# Altium schematic sheet Machnguyenli.SchDoc
size A
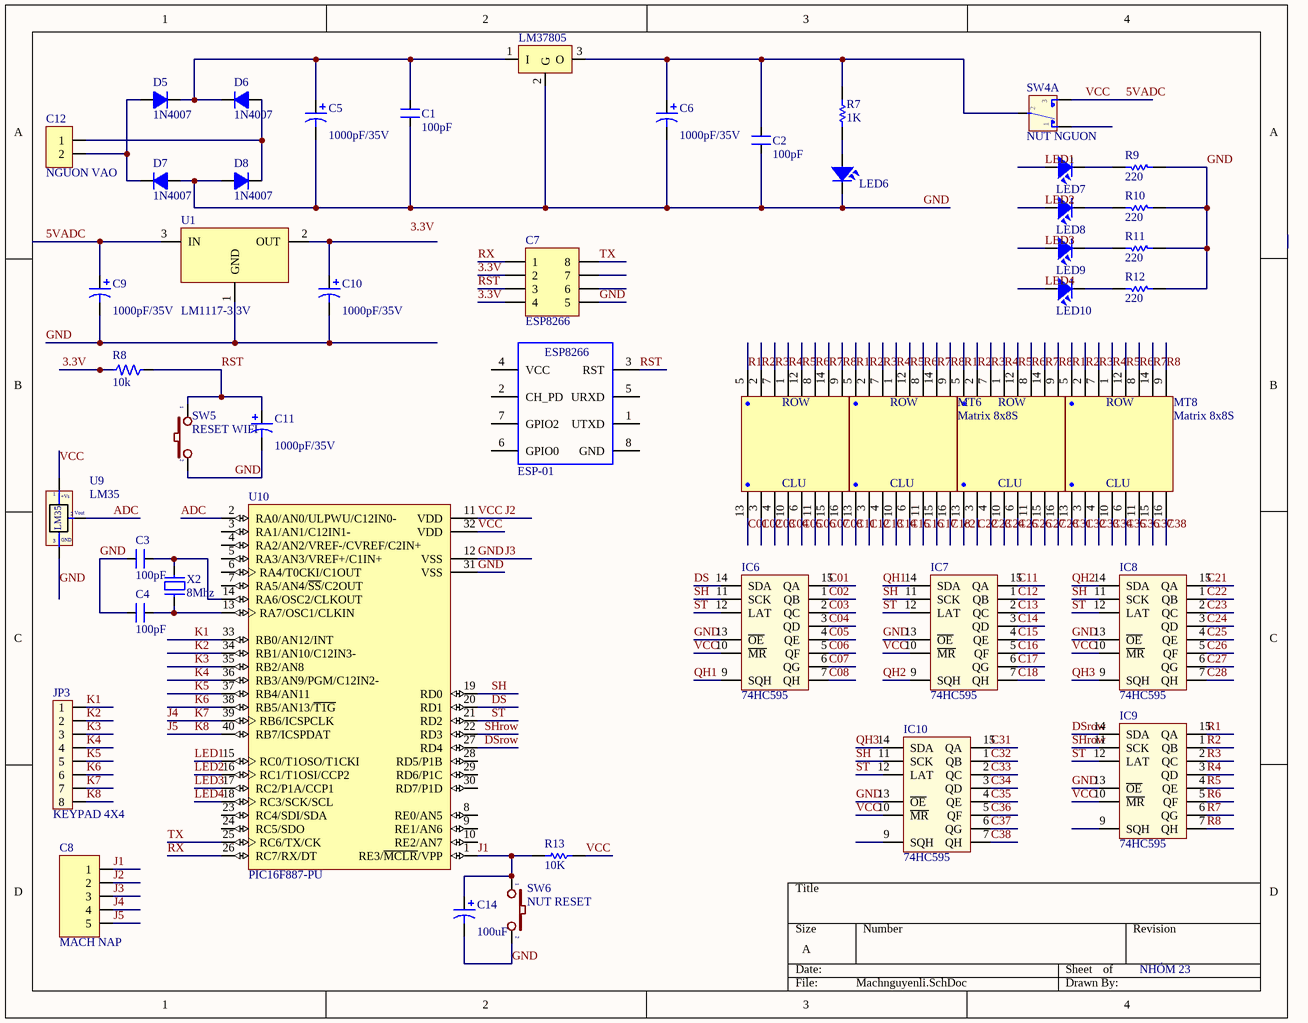
[diagram p0: Machnguyenli.SchDoc]

## Parts
C1  100pF  [CN1]
C2  100pF  [CN1]
C3  100pF  [CN1]
C4  100pF  [CN1]
C5  value 1000pF/35V  [CP2/5]
C6  value 1000pF/35V  [CP2/5]
C7  ESP8266  [J4-C2T]
C8  MACH NAP  [JP5-C1T]
C9  value 1000pF/35V  [CP2/5]
C10  value 1000pF/35V  [CP2/5]
C11  value 1000pF/35V  [CP2/5]
C12  NGUON VAO  [JP2-C1T]
C14  value 100uF  [CP2/5]
D5  1N4007  [D1A]
D6  1N4007  [D1A]
D7  1N4007  [D1A]
D8  1N4007  [D1A]
IC6  74HC595  [DIP16]
IC7  74HC595  [DIP16]
IC8  74HC595  [DIP16]
IC9  74HC595  [DIP16]
IC10  74HC595  [DIP16]
JP3  KEYPAD 4X4  [JP8]
LED6  LED  [LED-3]  (value not drawn)
LED7  LED  [LED-3]  (value not drawn)
LED8  LED  [LED-3]  (value not drawn)
LED9  LED  [LED-3]  (value not drawn)
LED10  LED  [LED-3]  (value not drawn)
LM37805  LM78xx  [TO220-123]  (value not drawn)
MT5  Matrix 8x8S  [Matrix]
MT6  Matrix 8x8S  [Matrix]
MT7  Matrix 8x8S  [Matrix]
MT8  Matrix 8x8S  [Matrix]
R7  value 1K  [R1/4W]  (hidden comment: Res1)
R8  10k  [SM-RES-1206]
R9  value 220  [R1/4W]  (hidden comment: Res1)
R10  value 220  [R1/4W]  (hidden comment: Res1)
R11  value 220  [R1/4W]  (hidden comment: Res1)
R12  value 220  [R1/4W]  (hidden comment: Res1)
R13  value 10K  [R1/4W]  (hidden comment: Res1)
SW4  NUT NGUON  [SW6]  (part A of 2)
SW5  RESET WIFI  [SW2]
SW6  NUT RESET  [SW2]
U1  LM1117-3.3V  [SOT223]
U2  ESP-01  [ESP8266]
U9  LM35  [TO92-123]
U10  PIC16F887-PU  [DIP40/W0.6]
X2  8Mhz  [XT2]

## Nets
5VADC: C8.2 C9.1 IC6.10(~{MR}) IC6.16(VCC) IC7.10(~{MR}) IC7.16(VCC) IC8.10(~{MR}) IC8.16(VCC) IC9.10(~{MR}) IC9.16(VCC) IC10.10(~{MR}) IC10.16(VCC) R13.1 SW4.3 U1.3(IN) U9.1(+Vs) U10.11(VDD) U10.32(VDD)  [also labelled J2, VCC]
GND: C1.1 C2.1 C3.1 C4.1 C5.2 C6.2 C7.5 C8.3 C9.2 C10.2 C11.2 C14.2 D7.1(A) D8.1(A) IC6.8(GND) IC6.13(~{OE}) IC7.8(GND) IC7.13(~{OE}) IC8.8(GND) IC8.13(~{OE}) IC9.8(GND) IC9.13(~{OE}) IC10.8(GND) IC10.13(~{OE}) LED6.2 LM37805.2(G) R9.1 R10.1 R11.1 R12.1 SW5.2 SW6.2 U1.1(GND) U9.3(-) U10.12(VSS) U10.31(VSS)  [also labelled J3]
3.3V: C7.2 C7.4 R8.2
ADC: U9.2(Vout) U10.2(RA0/AN0/ULPWU/C12IN0-)
C01: IC6.15(QA) MT5.13(C1)
C02: IC6.1(QB) MT5.3(C2)
C03: IC6.2(QC) MT5.4(C3)
C04: IC6.3(QD) MT5.10(C4)
C05: IC6.4(QE) MT5.6(C5)
C06: IC6.5(QF) MT5.11(C6)
C07: IC6.6(QG) MT5.15(C7)
C08: IC6.7(QH) MT5.16(C8)
C11: IC7.15(QA) MT6.13(C1)
C12: IC7.1(QB) MT6.3(C2)
C13: IC7.2(QC) MT6.4(C3)
C14: IC7.3(QD) MT6.10(C4)
C15: IC7.4(QE) MT6.6(C5)
C16: IC7.5(QF) MT6.11(C6)
C17: IC7.6(QG) MT6.15(C7)
C18: IC7.7(QH) MT6.16(C8)
C21: IC8.15(QA) MT7.13(C1)
C22: IC8.1(QB) MT7.3(C2)
C23: IC8.2(QC) MT7.4(C3)
C24: IC8.3(QD) MT7.10(C4)
C25: IC8.4(QE) MT7.6(C5)
C26: IC8.5(QF) MT7.11(C6)
C27: IC8.6(QG) MT7.15(C7)
C28: IC8.7(QH) MT7.16(C8)
C31: IC10.15(QA) MT8.13(C1)
C32: IC10.1(QB) MT8.3(C2)
C33: IC10.2(QC) MT8.4(C3)
C34: IC10.3(QD) MT8.10(C4)
C35: IC10.4(QE) MT8.6(C5)
C36: IC10.5(QF) MT8.11(C6)
C37: IC10.6(QG) MT8.15(C7)
C38: IC10.7(QH) MT8.16(C8)
DS: IC6.14(SDA) U10.20(RD1)
DSrow: IC9.14(SDA) U10.27(RD4)
J1: C8.1 C14.1 R13.2 SW6.1 U10.1(RE3/~{MCLR}/VPP)
J4: C8.4 JP3.7 U10.39(RB6/ICSPCLK)  [also labelled K7]
J5: C8.5 JP3.8 U10.40(RB7/ICSPDAT)  [also labelled K8]
K1: JP3.1 U10.33(RB0/AN12/INT)
K2: JP3.2 U10.34(RB1/AN10/C12IN3-)
K3: JP3.3 U10.35(RB2/AN8)
K4: JP3.4 U10.36(RB3/AN9/PGM/C12IN2-)
K5: JP3.5 U10.37(RB4/AN11)
K6: JP3.6 U10.38(RB5/AN13/~{T1G})
LED1: LED7.1 U10.15(RC0/T1OSO/T1CKI)
LED2: LED8.1 U10.16(RC1/T1OSI/CCP2)
LED3: LED9.1 U10.17(RC2/P1A/CCP1)
LED4: LED10.1 U10.18(RC3/SCK/SCL)
QH1: IC6.9(SQH) IC7.14(SDA)
QH2: IC7.9(SQH) IC8.14(SDA)
QH3: IC8.9(SQH) IC10.14(SDA)
R1: IC9.15(QA) MT5.5(H1) MT6.5(H1) MT7.5(H1) MT8.5(H1)
R2: IC9.1(QB) MT5.2(H2) MT6.2(H2) MT7.2(H2) MT8.2(H2)
R3: IC9.2(QC) MT5.7(H3) MT6.7(H3) MT7.7(H3) MT8.7(H3)
R4: IC9.3(QD) MT5.1(H4) MT6.1(H4) MT7.1(H4) MT8.1(H4)
R5: IC9.4(QE) MT5.12(H5) MT6.12(H5) MT7.12(H5) MT8.12(H5)
R6: IC9.5(QF) MT5.8(H6) MT6.8(H6) MT7.8(H6) MT8.8(H6)
R7: IC9.6(QG) MT5.14(H7) MT6.14(H7) MT7.14(H7) MT8.14(H7)
R8: IC9.7(QH) MT5.9(H8) MT6.9(H8) MT7.9(H8) MT8.9(H8)
RST: C7.3 C11.1 R8.1 SW5.1 U2.3(RST)
RX: C7.1 U10.26(RC7/RX/DT)
SH: IC6.11(SCK) IC7.11(SCK) IC8.11(SCK) IC10.11(SCK) U10.19(RD0)
SHrow: IC9.11(SCK) U10.22(RD3)
ST: IC6.12(LAT) IC7.12(LAT) IC8.12(LAT) IC9.12(LAT) IC10.12(LAT) U10.21(RD2)
TX: C7.8 U10.25(RC6/TX/CK)
NetC1_2: C1.2 C5.1 D5.2(K) D6.2(K) LM37805.1(I)
NetC2_2: C2.2 C6.1 LM37805.3(O) R7.2 SW4.2
NetC3_2: C3.2 U10.14(RA6/OSC2/CLKOUT) X2.2
NetC4_2: C4.2 U10.13(RA7/OSC1/CLKIN) X2.1
NetC10_1: C10.1 U1.2(OUT)
NetC12_1: C12.1 D6.1(A) D8.2(K)
NetC12_2: C12.2 D5.1(A) D7.2(K)
NetLED6_1: LED6.1 R7.1
NetLED7_2: LED7.2 R9.2
NetLED8_2: LED8.2 R10.2
NetLED9_2: LED9.2 R11.2
NetLED10_2: LED10.2 R12.2

Not connected (* = marked no-connect by the designer): C7 6 7; IC9 9(SQH); IC10 9(SQH); SW4 1; U2 1(UTXD) 2(CH_PD) 4(VCC) 5(URXD) 6(GPIO0) 7(GPIO2) 8(GND); U10 3(RA1/AN1/C12IN1-) 4(RA2/AN2/VREF-/CVREF/C2IN+) 5(RA3/AN3/VREF+/C1IN+) 6(RA4/T0CKI/C1OUT) 7(RA5/AN4/~{SS}/C2OUT) 8(RE0/AN5) 9(RE1/AN6) 10(RE2/AN7) 23(RC4/SDI/SDA) 24(RC5/SDO) 28(RD5/P1B) 29(RD6/P1C) 30(RD7/P1D)

## Notes on the sheet
- NHÓM 23
- Labels drawn without touching a wire or pin: 3.3V
- (in symbol ESP8266-01) ESP8266
- (in symbol LED 8x8S) ROW; CLU
- (in symbol LM35) GND

## Library data of the parts
C1-C4 = CN1: Cap np  1pF - 472pF; Value: 100pF
C5 C6 = Cap Pol3_2: Polarized Capacitor (Surface Mount); VALUE: C?; LatestRevisionDate: 17-Jul-2002; LatestRevisionNote: Re-released for DXP Platform.; PackageReference: C0805; Publisher: Altium Limited
C7 = JP4x2-2.0: WR-PHD 2.00 mm Dual Pin Header; Manufacturer: W¨¹rth Elektronik eiSos GmbH; partNo: 62000821121; ComponentLink1 Description: Manufacturer; ComponentLink2 Description: Datasheet; NoPins: 08; Created Date: 2 April 2013; ComponentLink1URL: http://www.we-online.com; ComponentLink2URL: http://katalog.we-online.de/em/datasheet/6200xx21121.pdf; Created by: Karrer Zheng
C8 = JP5: WR-PHD 2.54 mm Angled Socket Header; Manufacturer: W¨¹rth Elektronik eiSos GmbH; partNo: 613005143121; ComponentLink1 Description: Manufacturer; ComponentLink2 Description: Datasheet; NoPins: 05; Created Date: 29 March 2013; ComponentLink1URL: http://www.we-online.com; ComponentLink2URL: http://katalog.we-online.de/em/datasheet/6130xx143121.pdf; Created by: Karrer Zheng
C9-C11 C14 = Cap Pol3: Polarized Capacitor (Surface Mount); VALUE: C?; LatestRevisionDate: 17-Jul-2002; LatestRevisionNote: Re-released for DXP Platform.; PackageReference: C0805; Publisher: Altium Limited
C12 = JP2: WR-PHD 2.54 mm Angled Socket Header; Manufacturer: W¨¹rth Elektronik eiSos GmbH; partNo: 613002143121; ComponentLink1 Description: Manufacturer; ComponentLink2 Description: Datasheet; NoPins: 02; Created Date: 29 March 2013; ComponentLink1URL: http://www.we-online.com; ComponentLink2URL: http://katalog.we-online.de/em/datasheet/6130xx143121.pdf; Created by: Karrer Zheng
D5-D8 = D1A: Diode 1A; Value: 1N4007
IC6-IC10 = 74595: 8 Bit Serial input - Parallel Output; Value: 74HC595
JP3 = JP8: JP8 PIN; Value: JP7
LED6-LED10 = LED: LED Single colour Green and Red; Value: LED 3 ly Single Colour
LM37805 = LM78xx: Positive Voltage Regulator; Note: Tab is connected to pin 3 (GND).; Published: 24-Aug-2001; LatestRevisionDate: 17-Jul-2002; LatestRevisionNote: Re-released for DXP Platform.; DatasheetVersion: Apr-1994; PackageVersion: Jul-1998; PackageReference: ISOWATT220AB; Publisher: Altium Limited; PackageDescription: TO, Thru-Hole, Vertical, Heatsink Mounted; 3 In-Line Leads; Pitch 2.54 mm; Pin sequence 1, 3, 2; ComponentLink1Description: Manufacturer Link; ComponentLink1URL: http://www.st.com/; ComponentLink2Description: Datasheet; ComponentLink2URL: http://www.st.com/stonline/products/literature/ds/2146/l78m05c.pdf
MT5-MT8 = LED 8x8S: Matrix 8x8,  Single colour; Value: Matrix 8x8S
R7 R9-R13 = Res1_4: Resistor; Manufacturer: Generic Components; Class: Passive; Published: 08/06/2000; Publisher: Altium Hobart Technology Centre; SubClass: Resistor
R8 = R: Resistor 1/4W; Value: R1/4W - 1K
SW4 = SW6A: SW-DTDP - 6 Pin; Value: SW6
SW5 SW6 = SW2: Switch button 2 pin; Value: SW chip 2 pin
U1 = LM1117: 800mA Low-Dropout Linear Regulator; Creator: Nguyen Ba Bien; Website: http://group3i.net
U2 = ESP8266-01: ESP-12 Wi-Fi Module
U9 = LM35: Teminal; Value: LM35
U10 = PIC16F887-PU: Flash-Based, 8-Bit CMOS Microcontroller with nanoWatt Technology, 8K (x14-Bit words) Program Memory, 624 Bytes Data Memory, 35 I/O pins, 40-Pin PDIP, Standard VDD Range, Extended Temperature; Published: 29-Jan-2009; LatestRevisionDate: 02-Dec-2009; LatestRevisionNote: Updated datasheet to version revF, Apr-2009.; DatasheetVersion: revF, Apr-2009; PackageVersion: revBB, Aug-2009; PackageReference: PDIP600-P40; Publisher: Altium Limited; PackageDescription: 40-Lead Plastic Dual In-Line (P) - 600 mil Body [PDIP]; Supplier 1: Digi-Key; Supplier Part Number 1: PIC16F887-E/P-ND; Supplier 2: Farnell; Supplier Part Number 2: 1703423; ComponentLink1Description: Datasheet; ComponentLink1URL: http://ww1.microchip.com/downloads/en/DeviceDoc/41291F.pdf; ComponentLink2Description: Packaging Specification; ComponentLink2URL: http://www.microchip.com/stellent/groups/techpub_sg/documents/packagingspec/en012702.pdf; ComponentLink3Description: Microchip.com Home; ComponentLink3URL: http://www.microchip.com/
X2 = XT2: Crystal For all Crystal 2pin.; Value: 4Mhz